# EAGLE schematic Communication_Module_v2 (EAGLE 7.5.0)
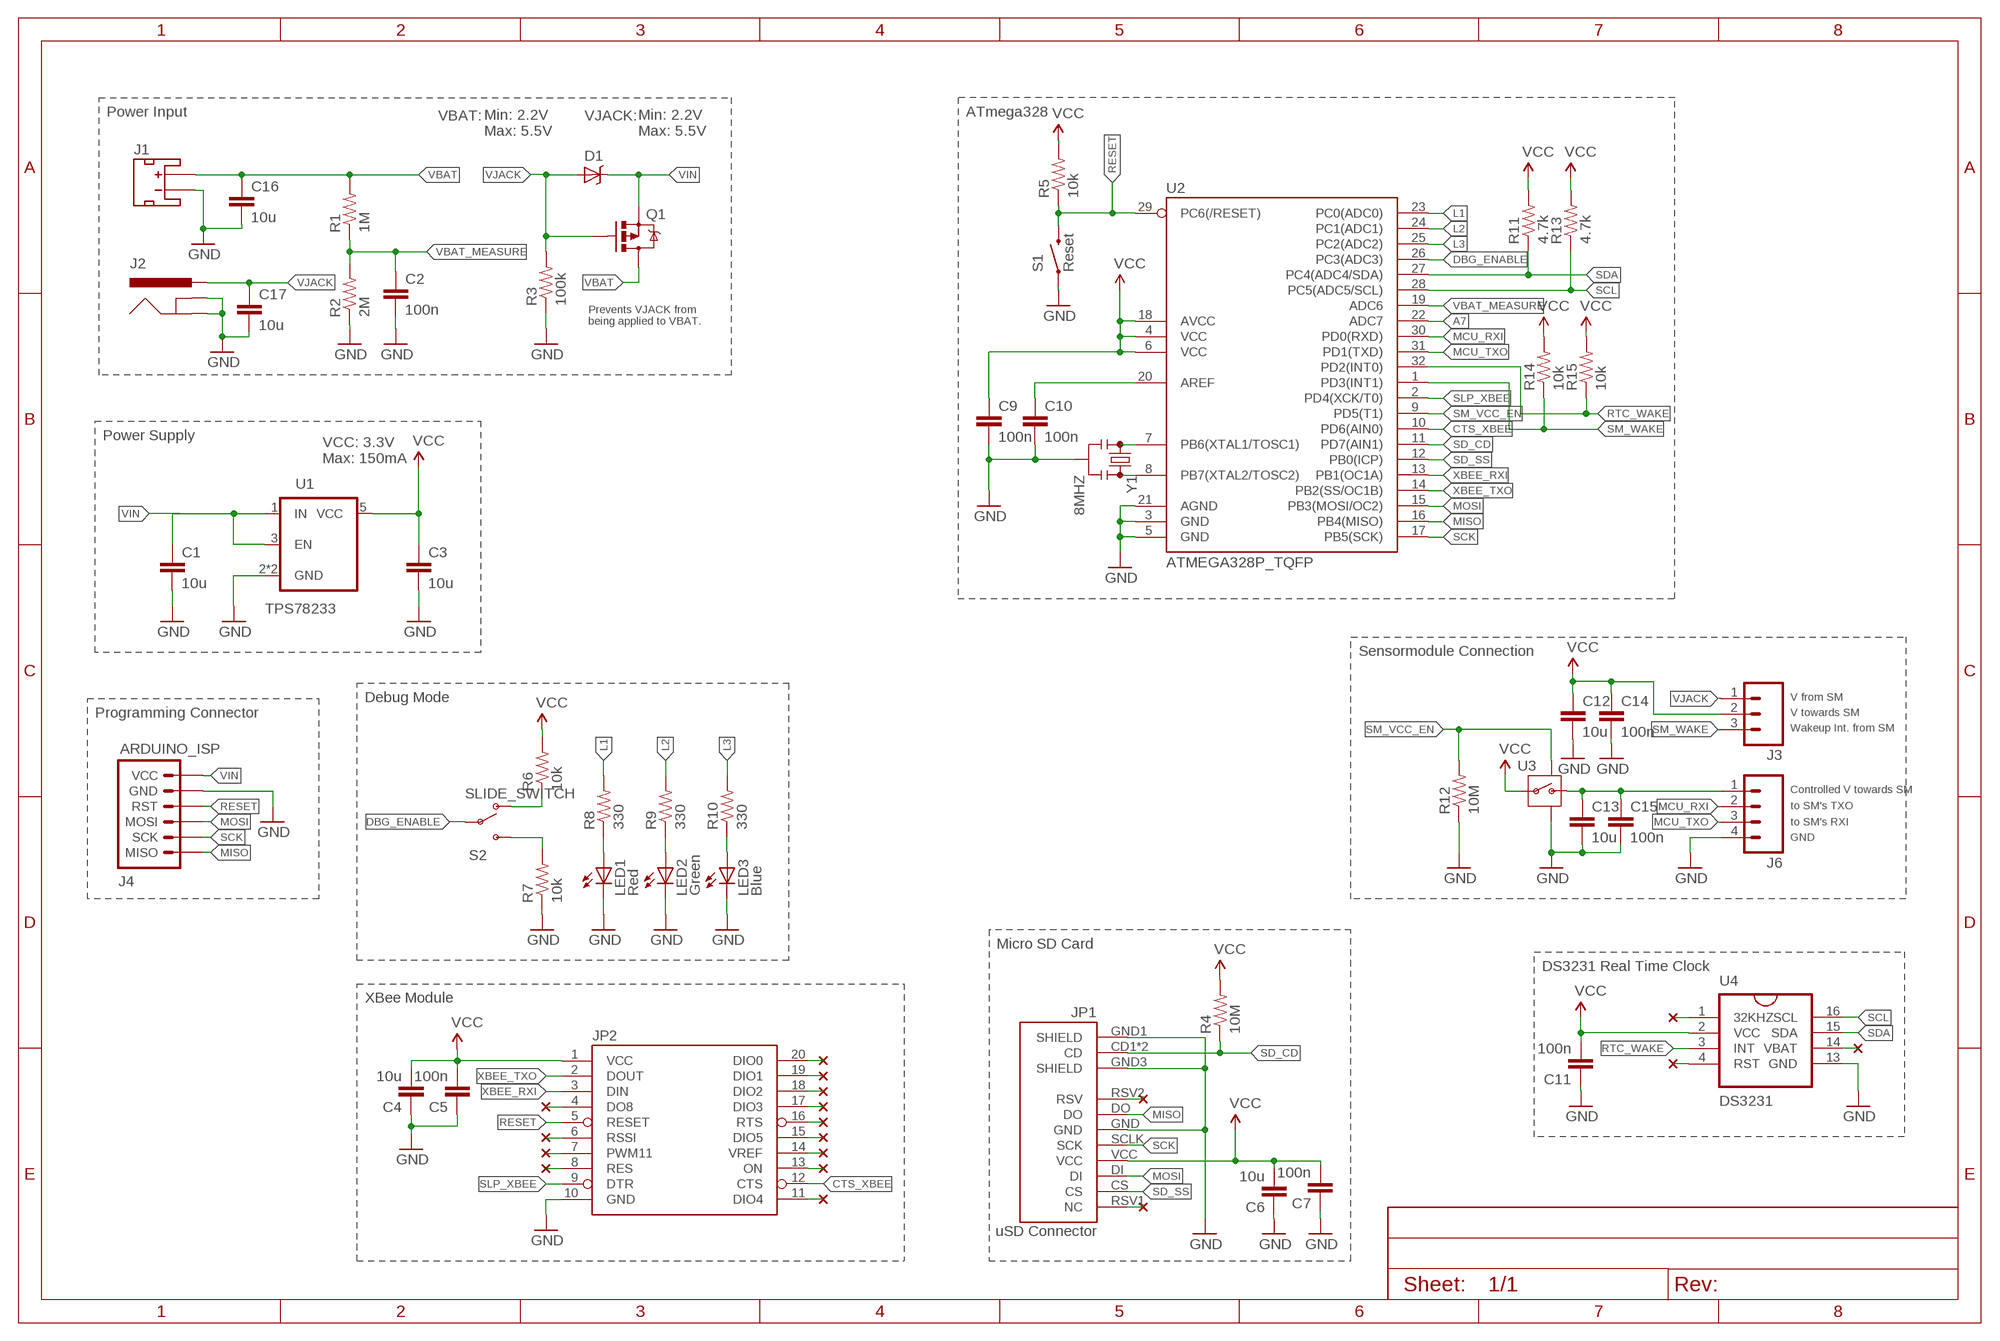
[diagram p0: schematic, sheet 1]
FRAME1 (FRAME-A4L): CNAME: Communication Module; CREVISION: 2.0

## Parts
C1  10u  C  [C0805]
C2  100n  C  [C0805]
C3  10u  C  [C0805]
C4  10u  C  [C0805]
C5  100n  C  [C0805]
C6  10u  C  [C0805]
C7  100n  C  [C0805]
C9  100n  C  [C0805]
C10  100n  C  [C0805]
C11  100n  C  [C0805]
C12  10u  C  [C0805]
C13  10u  C  [C0805]
C14  100n  C  [C0805]
C15  100n  C  [C0805]
C16  10u  C  [C0805]
C17  10u  C  [C0805]
D1  DIODE-SCHOTTKY  [0603-DIODE]
J1  JST_2MM_MALE  [JST-2-SMD]
J2  5.5x2.1mm Barrel  POWER_JACKSMD  [POWER_JACK_SMD]
J3  M03PTH  [1X03]
J4  ARDUINO_ISP  [M-2X3]
J6  M04PTH  [1X04]
JP1  USD-SOCKETNEW  [MICRO-SD-SOCKET-PP]
JP2  XBEEB3  [XBEE-SMD]
LED1  Red  LEDSML0805  [SML0805]
LED2  Green  LEDSML0805  [SML0805]
LED3  Blue  LEDSML0805  [SML0805]
Q1  PFET  MOSFET-PCHANNELSMD  [SOT23-3]
R1  1M  RESISTOR0805-RES  [0805]
R2  2M  RESISTOR0805-RES  [0805]
R3  100k  RESISTOR0805-RES  [0805]
R4  10M  RESISTOR0805-RES  [0805]
R5  10k  RESISTOR0805-RES  [0805]
R6  10k  RESISTOR0805-RES  [0805]
R7  10k  RESISTOR0805-RES  [0805]
R8  330  RESISTOR0805-RES  [0805]
R9  330  RESISTOR0805-RES  [0805]
R10  330  RESISTOR0805-RES  [0805]
R11  4.7k  RESISTOR0805-RES  [0805]
R12  10M  RESISTOR0805-RES  [0805]
R13  4.7k  RESISTOR0805-RES  [0805]
R14  10k  RESISTOR0805-RES  [0805]
R15  10k  RESISTOR0805-RES  [0805]
S1  Reset  PUSHBUTTON  [M-PUSHBUTTON-SMD]
S2  SLIDE_SWITCH  [P-JS202011SCQN]
U1  TPS78233  [SOT23-5]
U2  ATMEGA328P_TQFP  [TQFP32-08]
U3  SIP32431  [SC70]
U4  DS3231SOIC16  [SO016]
Y1  8MHZ  RESONATOR8MHZ  [RESONATOR-SMD]

## Nets
A7: U2.22(ADC7)
CTS_XBEE: JP2.12(CTS) U2.10(PD6(AIN0))
DBG_ENABLE: S2.P$2(MIDDLE) S2.P$5(MIDDLE) U2.26(PC3(ADC3))
GND [GND]: C1.2 C2.2 C3.2 C4.1 C5.1 C6.1 C7.1 C9.2 C10.2 C11.1 C12.2 C13.2 C14.2 C15.2 C16.2 C17.2 J1.1(-) J2.GND(GNDBREAK) J2.P$4(GND) J4.P$5(GND) J6.4 JP1.GND JP1.GND1(SHIELD) JP1.GND3(SHIELD) JP2.10(GND) LED1.C LED2.C LED3.C R2.1 R3.1 R7.1 R12.1 S1.1(LEFT) S1.2(LEFT) U1.2(GND) U1.4(GND) U2.3(GND) U2.5(GND) U2.21(AGND) U3.2(GND) U3.5(GND) U3.6(GND) U4.13(GND) Y1.2
L1: R8.2 U2.23(PC0(ADC0))
L2: R9.2 U2.24(PC1(ADC1))
L3: R10.2 U2.25(PC2(ADC2))
MCU_RXI: J6.2 U2.30(PD0(RXD))
MCU_TXO: J6.3 U2.31(PD1(TXD))
MISO: J4.P$1(MISO) JP1.DO U2.16(PB4(MISO))
MOSI: J4.P$3(MOSI) JP1.DI U2.15(PB3(MOSI/OC2))
N$1: U2.8(PB7(XTAL2/TOSC2)) Y1.3
N$2: U2.7(PB6(XTAL1/TOSC1)) Y1.1
N$3: JP1.RSV1(NC)
N$4: U4.1(32KHZ)
N$5: LED3.A R10.1
N$6: JP2.4(DO8)
N$8: JP2.6(RSSI)
N$9: JP2.7(PWM11)
N$10: JP2.8(RES)
N$11: LED2.A R9.1
N$12: U4.4(RST)
N$13: JP2.11(DIO4)
N$14 [Vsupply]: C13.1 C15.1 J6.1 U3.1(OUT)
N$15: C10.1 U2.20(AREF)
N$16: JP2.14(VREF)
N$17: JP2.15(DIO5)
N$18: JP2.16(RTS)
N$19: JP2.17(DIO3)
N$20: JP2.18(DIO2)
N$21: JP2.19(DIO1)
N$22: JP2.20(DIO0)
N$23: JP1.RSV2(RSV)
N$24: JP2.13(ON)
N$30: LED1.A R8.1
N$31: U4.14(VBAT)
N$34: R7.2 S2.P$1(LOWER) S2.P$4(LOWER)
N$35: R6.1 S2.P$3(UPPER) S2.P$6(UPPER)
RESET: J4.P$4(RST) JP2.5(RESET) R5.1 S1.3(RIGHT) S1.4(RIGHT) U2.29(PC6(/RESET))
RTC_WAKE: R15.1 U2.32(PD2(INT0)) U4.3(INT)
SCK: J4.P$2(SCK) JP1.SCLK(SCK) U2.17(PB5(SCK))
SCL: R13.1 U2.28(PC5(ADC5/SCL)) U4.16(SCL)
SD_CD: JP1.CD1(CD) JP1.CD2(CD) R4.1 U2.11(PD7(AIN1))
SD_SS: JP1.CS U2.12(PB0(ICP))
SDA: R11.1 U2.27(PC4(ADC4/SDA)) U4.15(SDA)
SLP_XBEE: JP2.9(DTR) U2.2(PD4(XCK/T0))
SM_VCC_EN: R12.2 U2.9(PD5(T1)) U3.3(ON)
SM_WAKE: J3.3 R14.1 U2.1(PD3(INT1))
VBAT [Vsupply]: C16.1 J1.2(+) Q1.3(D) R1.2
VBAT_MEASURE: C2.1 R1.1 R2.2 U2.19(ADC6)
VCC [Vsupply]: C3.1 C4.2 C5.2 C6.2 C7.2 C9.1 C11.2 C12.1 C14.1 J3.2 JP1.VCC JP2.1(VCC) R4.2 R5.2 R6.2 R11.2 R13.2 R14.2 R15.2 U1.5(VCC) U2.4(VCC) U2.6(VCC) U2.18(AVCC) U3.4(IN) U4.2(VCC)
VIN [Vsupply]: C1.1 D1.C J4.P$6(VCC) Q1.2(S) U1.1(IN) U1.3(EN)
VJACK [Vsupply]: C17.1 D1.A J2.VIN0(PWR) J2.VIN1(PWR) J3.1 Q1.1(G) R3.2
XBEE_RXI: JP2.3(DIN) U2.13(PB1(OC1A))
XBEE_TXO: JP2.2(DOUT) U2.14(PB2(SS/OC1B))
Unconnected: J1.NC1(PAD1) J1.NC2(PAD2)

## Notes on the sheet
- Power Input | VBAT: | VJACK: | ATmega328
- Min: 2.2V
  Max: 5.5V
- Min: 2.2V
  Max: 5.5V
- Prevents VJACK from 
  being applied to VBAT.
- Power Supply
- VCC: 3.3V
  Max: 150mA
- Sensormodule Connection
- Debug Mode | V from SM
- Programming Connector | V towards SM
- Wakeup Int. from SM
- Controlled V towards SM
- to SM's TXO
- to SM's RXI
- GND
- Micro SD Card
- DS3231 Real Time Clock
- XBee Module

## Library data of the parts
C1-C7 C9-C17 = eagle-ltspice:C: CAPACITOR, European symbol; SPICEMODEL: NONE; SPICEPREFIX: C
D1 = Pinoccio:DIODE-SCHOTTKY
J1 = marc_library:JST_2MM_MALE: Mates to single-cell LiPo batteries. CONN-11443 Now with smashable polarity marks!; BTM_NEG: -; BTM_POS: +; PROD_ID: CONN-11443; TOP_NEG: -; TOP_POS: +
J2 = marc_library:POWER_JACK: Power Jack This is the standard 5.5mm barrel jack for power. The PTH is the most common, proven, reliable, footprint. The Slot footprint only works if the mill layer is transmitted to the PCB fab house so be warned. Mating wall wart : TOL-00298 (and others); PROD_ID: CONN-08106; SF_ID: PRT-12748
J3 = SparkFun-Connectors:M03: Header 3 Standard 3-pin 0.1" header. Use with straight break away headers (SKU : PRT-00116), right angle break away headers (PRT-00553), swiss pins (PRT-00743), machine pins (PRT-00117), and female headers (PRT-00115). Molex polarized connector foot print use with SKU : PRT-08232 with associated crimp pins and housings.
J4 = marc_library:ARDUINO_ISP: AVR ISP 6-pin inline header for Arduino ISP
J6 = SparkFun-Connectors:M04: Header 4 Standard 4-pin 0.1" header. Use with straight break away headers (SKU : PRT-00116), right angle break away headers (PRT-00553), swiss pins (PRT-00743), machine pins (PRT-00117), and female headers (PRT-00115). Molex polarized connector foot print use with SKU : PRT-08231 with associated crimp pins and housings. 1MM SMD Version SKU: PRT-10208; PROD_ID: CONN-09696
JP1 = marc_library:USD-SOCKET: microSD Socket Push-push type uSD socket. Schematic element and footprint production proven. Spark Fun Electronics SKU : PRT-00127. tDoc lines correctly indicate media card edge positions when inserting (unlocked, locked, depressed). NOTE: CD1 and CD2 are connected internally; PROD_ID: CONN-07820
JP2 = marc_library:XBEE: Xbee module footprints; PROD_ID: CONN-09042
LED1-LED3 = led:LED: LED OSRAM: - CHIPLED LG R971, LG N971, LY N971, LG Q971, LY Q971, LO R971, LY R971 LH N974, LH R974 LS Q976, LO Q976, LY Q976 LO Q996 - Hyper CHIPLED LW Q18S LB Q993, LB Q99A, LB R99A - SideLED LS A670, LO A670, LY A670, LG A670, LP A670 LB A673, LV A673, LT A673, LW A673 LH A674 LY A675 LS A676, LA A676, LO A676, LY A676, LW A676 LS A679, LY A679, LG A679 - Hyper Micro SIDELED® LS Y876, LA Y876, LO Y876, LY Y876 LT Y87S - SmartLED LW L88C, LW L88S LB L89C, LB L89S, LG L890 LS L89K, LO L89K, LY L89K LS L896, LA L896, LO L896, LY L896 - TOPLED LS T670, LO T670, LY T670, LG T670, LP T670 LSG T670, LSP T670, LSY T670, LOP T670, LYG T670 LG T671, LOG T671, LSG T671 LB T673, LV T673, LT T673, LW T673 LH T674 LS T676, LA T676, LO T676, LY T676, LB T676, LH T676, LSB T676, LW T676 LB T67C, LV T67C, LT T67C, LS T67K, LO T67K, LY T67K, LW E67C LS E67B, LA E67B, LO E67B, LY E67B, LB E67C, LV E67C, LT E67C LW T67C LS T679, LY T679, LG T679 LS T770, LO T770, LY T770, LG T770, LP T770 LB T773, LV T773, LT T773, LW T773 LH T774 LS E675, LA E675, LY E675, LS T675 LS T776, LA T776, LO T776, LY T776, LB T776 LHGB T686 LT T68C, LB T68C - Hyper Mini TOPLED® LB M676 - Mini TOPLED Santana® LG M470 LS M47K, LO M47K, LY M47K Source: http://www.osram.convergy.de LUXEON: - LUMILED® LXK2-PW12-R00, LXK2-PW12-S00, LXK2-PW14-U00, LXK2-PW14-V00 LXK2-PM12-R00, LXK2-PM12-S00, LXK2-PM14-U00 LXK2-PE12-Q00, LXK2-PE12-R00, LXK2-PE12-S00, LXK2-PE14-T00, LXK2-PE14-U00 LXK2-PB12-K00, LXK2-PB12-L00, LXK2-PB12-M00, LXK2-PB14-N00, LXK2-PB14-P00, LXK2-PB14-Q00 LXK2-PR12-L00, LXK2-PR12-M00, LXK2-PR14-Q00, LXK2-PR14-R00 LXK2-PD12-Q00, LXK2-PD12-R00, LXK2-PD12-S00 LXK2-PH12-R00, LXK2-PH12-S00 LXK2-PL12-P00, LXK2-PL12-Q00, LXK2-PL12-R00 Source: www.luxeon.com KINGBRIGHT: KA-3528ASYC Source: www.kingbright.com
Q1 = Pinoccio:MOSFET-PCHANNEL
R1-R15 = SparkFun-Passives:RESISTOR: Resistor Basic schematic elements and footprints for 0603, 1206, and PTH resistors.
S1 = marc_library:PUSHBUTTON
S2 = marc_library:SLIDE_SWITCH: SWCH-10651 Side-actuated SPDT slide switch, as used on the Arduino Pro
U1 = marc_library:TPS78233: Voltage Regulator LDO 500nA Ground Current, 150mA, Ultra-Low Quiescent Current Low-Dropout Linear Regulator.
U2 = marc_library:ATMEGA328P_TQFP; PROD_ID: IC-09069
U3 = marc_library:SIP32431
U4 = marc_library:DS3231: RS232 Transceiver Very common IC. This is generically called 'MAX232', but works with the 3V equivalent MAX3232 generic ICs. Field tested and mother approved. Spark Fun Electronics SKU : COM-00316 (DIP) and COM-00589 (SMD); PROD_ID: IC-08171
Y1 = marc_library:RESONATOR: Resonator Small SMD resonator. Used, eg, on the Arduino Pro/ Pro Mini boards. 8MHz- XTAL-08895 16MHz- XTAL-08900; PROD_ID: XTAL-08895

## Net classes
0 default: width 0.3 mm
1 Vsupply: width 0.5 mm
5 GND: width 0.5 mm